# EAGLE schematic Layout_Design_File (EAGLE 9.6.2)

## Sheet 1 of 2
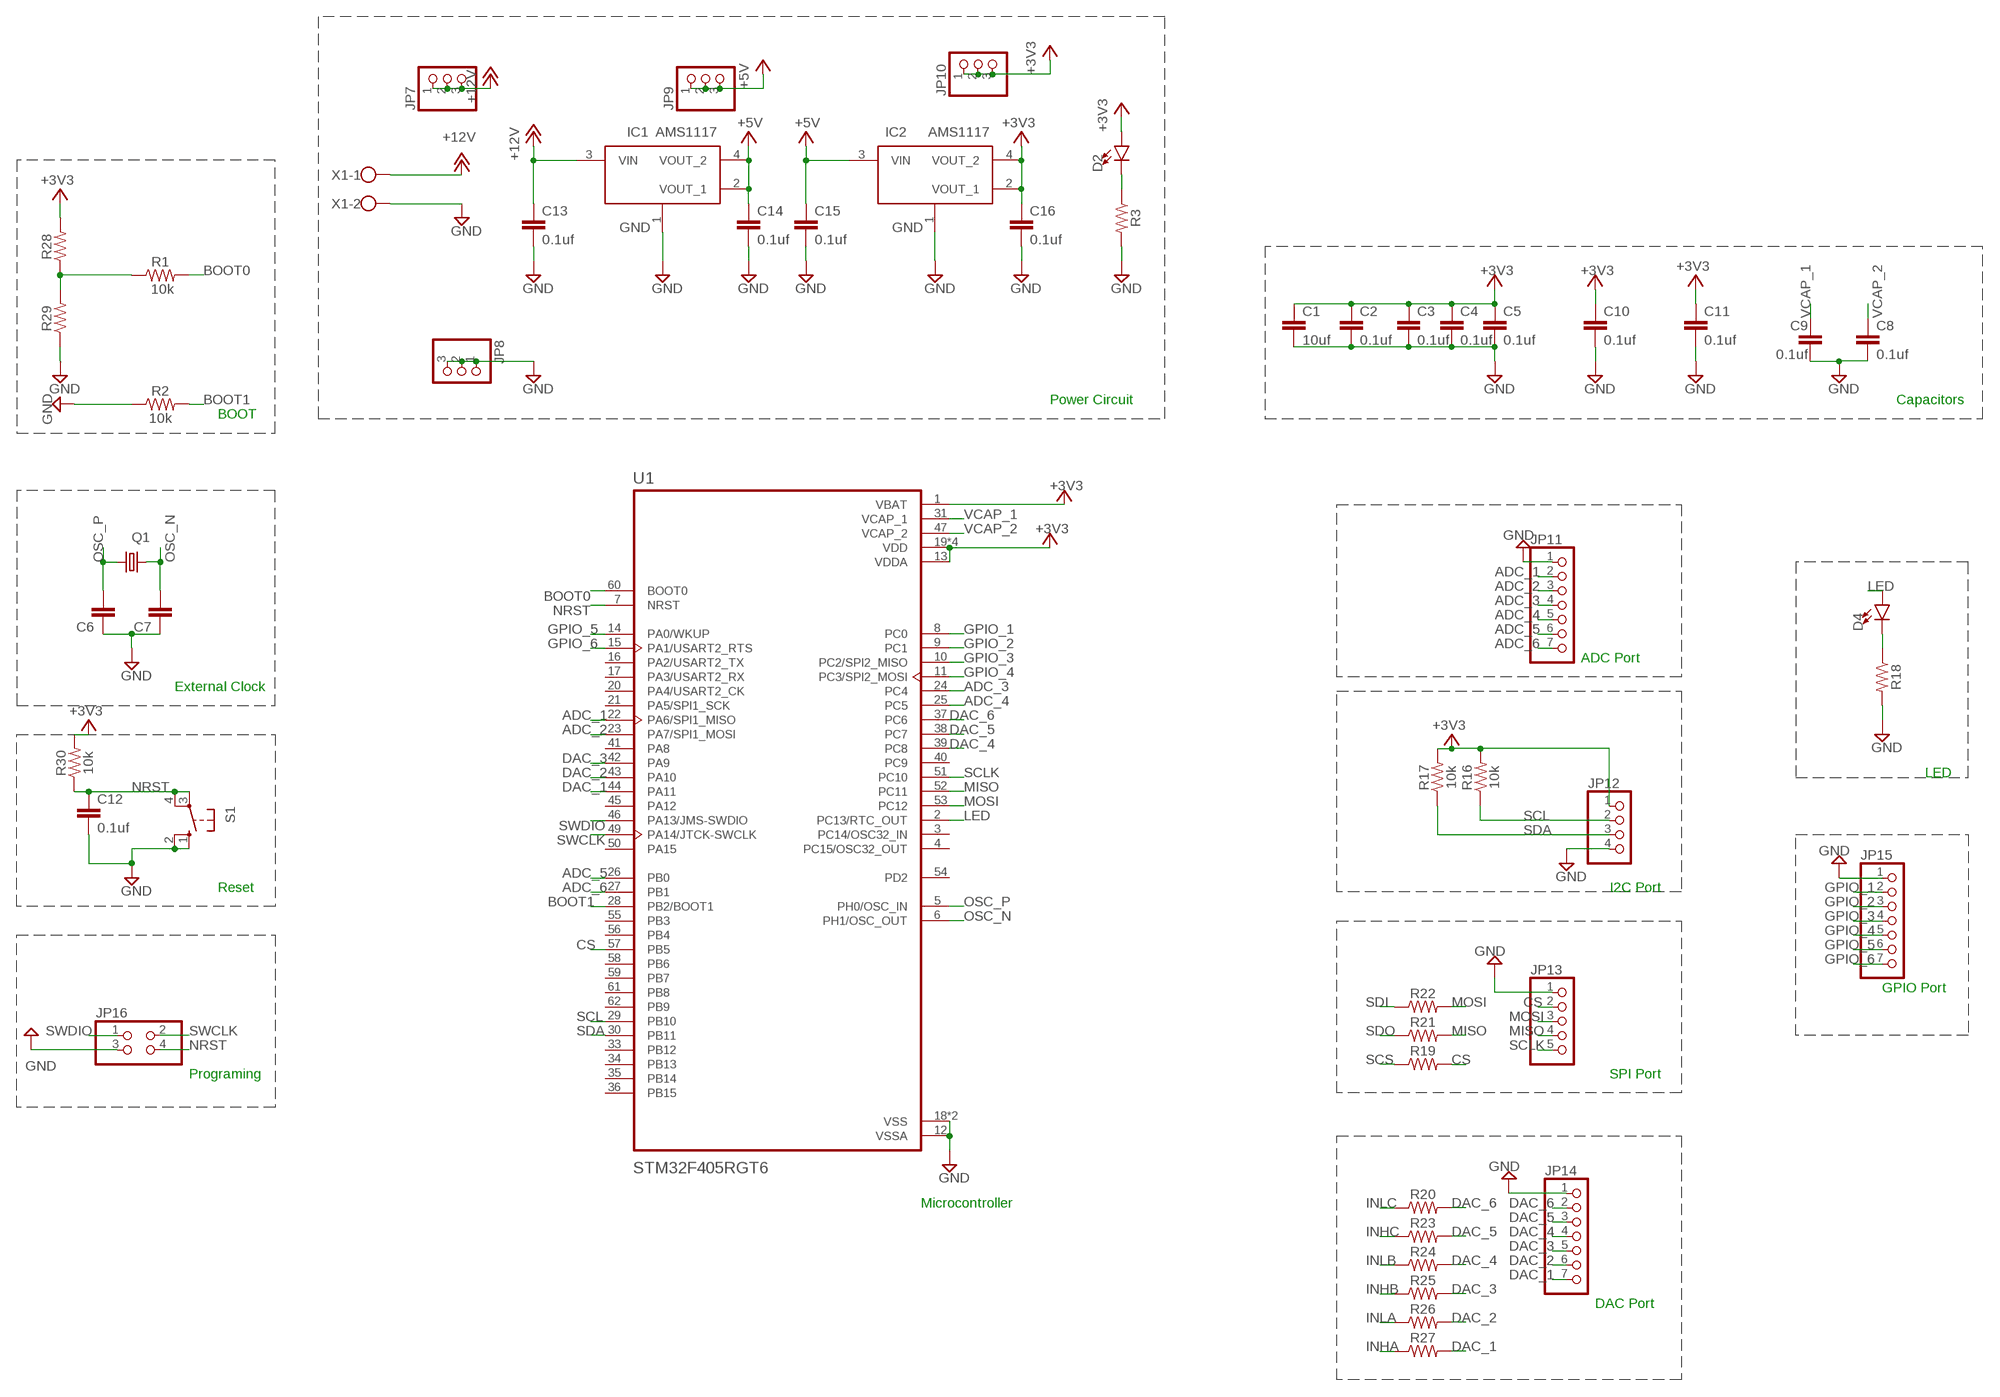
[diagram p0: schematic, sheet 1]

### Parts
C1  10uf  CAP-0603  [0603]
C2  0.1uf  CAP-0603  [0603]
C3  0.1uf  CAP-0603  [0603]
C4  0.1uf  CAP-0603  [0603]
C5  0.1uf  CAP-0603  [0603]
C6  CAP-0603  [0603]
C7  CAP-0603  [0603]
C8  0.1uf  CAP-0603  [0603]
C9  0.1uf  CAP-0603  [0603]
C10  0.1uf  CAP-0603  [0603]
C11  0.1uf  CAP-0603  [0603]
C12  0.1uf  CAP-0603  [0603]
C13  0.1uf  CAP-0603  [0603]
C14  0.1uf  CAP-0603  [0603]
C15  0.1uf  CAP-0603  [0603]
C16  0.1uf  CAP-0603  [0603]
D2  LED1206  [LED-1206]
D4  LED1206  [LED-1206]
IC1  AMS1117  [SOT229P700X180-4N]
IC2  AMS1117  [SOT229P700X180-4N]
JP7  PINHD-1X3  [1X03]
JP8  PINHD-1X3  [1X03]
JP9  PINHD-1X3  [1X03]
JP10  PINHD-1X3  [1X03]
JP11  PINHD-1X7  [1X07]
JP12  PINHD-1X4  [1X04]
JP13  PINHD-1X5  [1X05]
JP14  PINHD-1X7  [1X07]
JP15  PINHD-1X7  [1X07]
JP16  PINHD-2X2  [2X02]
Q1  CRYSTALHC49S  [HC49/S]
R1  10k  RESISTOR0603  [0603]
R2  10k  RESISTOR0603  [0603]
R3  RESISTOR0603  [0603]
R16  10k  RESISTOR0603  [0603]
R17  10k  RESISTOR0603  [0603]
R18  RESISTOR0603  [0603]
R19  RESISTOR0603  [0603]
R20  RESISTOR0603  [0603]
R21  RESISTOR0603  [0603]
R22  RESISTOR0603  [0603]
R23  RESISTOR0603  [0603]
R24  RESISTOR0603  [0603]
R25  RESISTOR0603  [0603]
R26  RESISTOR0603  [0603]
R27  RESISTOR0603  [0603]
R28  RESISTOR0603  [0603]
R29  RESISTOR0603  [0603]
R30  10k  RESISTOR0603  [0603]
S1  10-XX  [B3F-10XX]
U1  STM32F405RGT6  [QFP50P1200X1200X160-64N]
X1  W237-102  [W237-102]

### Nets
+3V3: C1.1 C2.1 C3.1 C4.1 C5.1 C10.1 C11.1 C16.1 D2.A IC2.2(VOUT_1) IC2.4(VOUT_2) JP10.1 JP10.2 JP10.3 JP12.1 R16.2 R17.2 R28.2 R30.2 U1.1(VBAT) U1.13(VDDA) U1.19(VDD) U1.32(VDD) U1.48(VDD) U1.64(VDD) ; also sheet 2
+5V: C14.1 C15.1 IC1.2(VOUT_1) IC1.4(VOUT_2) IC2.3(VIN) JP9.1 JP9.2 JP9.3
+12V: C13.1 IC1.3(VIN) JP7.1 JP7.2 JP7.3 X1.1 ; also sheet 2
ADC_1: JP11.2 U1.22(PA6/SPI1_MISO)
ADC_2: JP11.3 U1.23(PA7/SPI1_MOSI)
ADC_3: JP11.4 U1.24(PC4)
ADC_4: JP11.5 U1.25(PC5)
ADC_5: JP11.6 U1.26(PB0)
ADC_6: JP11.7 U1.27(PB1)
BOOT0: R1.2 U1.60(BOOT0)
BOOT1: R2.2 U1.28(PB2/BOOT1)
CS: JP13.2 R19.2 U1.57(PB5)
DAC_1: JP14.7 R27.2 U1.44(PA11)
DAC_2: JP14.6 R26.2 U1.43(PA10)
DAC_3: JP14.5 R25.2 U1.42(PA9)
DAC_4: JP14.4 R24.2 U1.39(PC8)
DAC_5: JP14.3 R23.2 U1.38(PC7)
DAC_6: JP14.2 R20.2 U1.37(PC6)
GND: C1.2 C2.2 C3.2 C4.2 C5.2 C6.1 C7.1 C8.2 C9.2 C10.2 C11.2 C12.2 C13.2 C14.2 C15.2 C16.2 IC1.1(GND) IC2.1(GND) JP8.1 JP8.2 JP8.3 JP11.1 JP12.4 JP13.1 JP14.1 JP15.1 JP16.3 R2.1 R3.2 R18.2 R29.1 S1.1(S) S1.2(S1) U1.12(VSSA) U1.18(VSS) U1.63(VSS) X1.2 ; also sheet 2
GPIO_1: JP15.2 U1.8(PC0)
GPIO_2: JP15.3 U1.9(PC1)
GPIO_3: JP15.4 U1.10(PC2/SPI2_MISO)
GPIO_4: JP15.5 U1.11(PC3/SPI2_MOSI)
GPIO_5: JP15.6 U1.14(PA0/WKUP)
GPIO_6: JP15.7 U1.15(PA1/USART2_RTS)
INHA: R27.1 ; also sheet 2
INHB: R25.1 ; also sheet 2
INHC: R23.1 ; also sheet 2
INLA: R26.1 ; also sheet 2
INLB: R24.1 ; also sheet 2
INLC: R20.1 ; also sheet 2
LED: D4.A U1.2(PC13/RTC_OUT)
MISO: JP13.4 R21.2 U1.52(PC11)
MOSI: JP13.3 R22.2 U1.53(PC12)
N$1: D2.C R3.1
N$2: D4.C R18.1
N$3: R1.1 R28.1 R29.2
NRST: C12.1 JP16.4 R30.1 S1.3(P) S1.4(P1) U1.7(NRST)
OSC_N: C7.2 Q1.2 U1.6(PH1/OSC_OUT)
OSC_P: C6.2 Q1.1 U1.5(PH0/OSC_IN)
SCL: JP12.2 R16.1 U1.29(PB10)
SCLK: JP13.5 U1.51(PC10) ; also sheet 2
SCS: R19.1 ; also sheet 2
SDA: JP12.3 R17.1 U1.30(PB11)
SDI: R22.1 ; also sheet 2
SDO: R21.1 ; also sheet 2
SWCLK: JP16.2 U1.49(PA14/JTCK-SWCLK)
SWDIO: JP16.1 U1.46(PA13/JMS-SWDIO)
VCAP_1: C9.1 U1.31(VCAP_1)
VCAP_2: C8.1 U1.47(VCAP_2)
Unconnected: U1.3(PC14/OSC32_IN) U1.4(PC15/OSC32_OUT) U1.16(PA2/USART2_TX) U1.17(PA3/USART2_RX) U1.20(PA4/USART2_CK) U1.21(PA5/SPI1_SCK) U1.33(PB12) U1.34(PB13) U1.35(PB14) U1.36(PB15) U1.40(PC9) U1.41(PA8) U1.45(PA12) U1.50(PA15) U1.54(PD2) U1.55(PB3) U1.56(PB4) U1.58(PB6) U1.59(PB7) U1.61(PB8) U1.62(PB9)

### Notes on the sheet
- Power Circuit | Capacitors
- BOOT
- ADC Port
- External Clock
- LED
- Reset | I2C Port
- GPIO Port
- Programing | SPI Port
- Microcontroller
- DAC Port

## Sheet 2 of 2
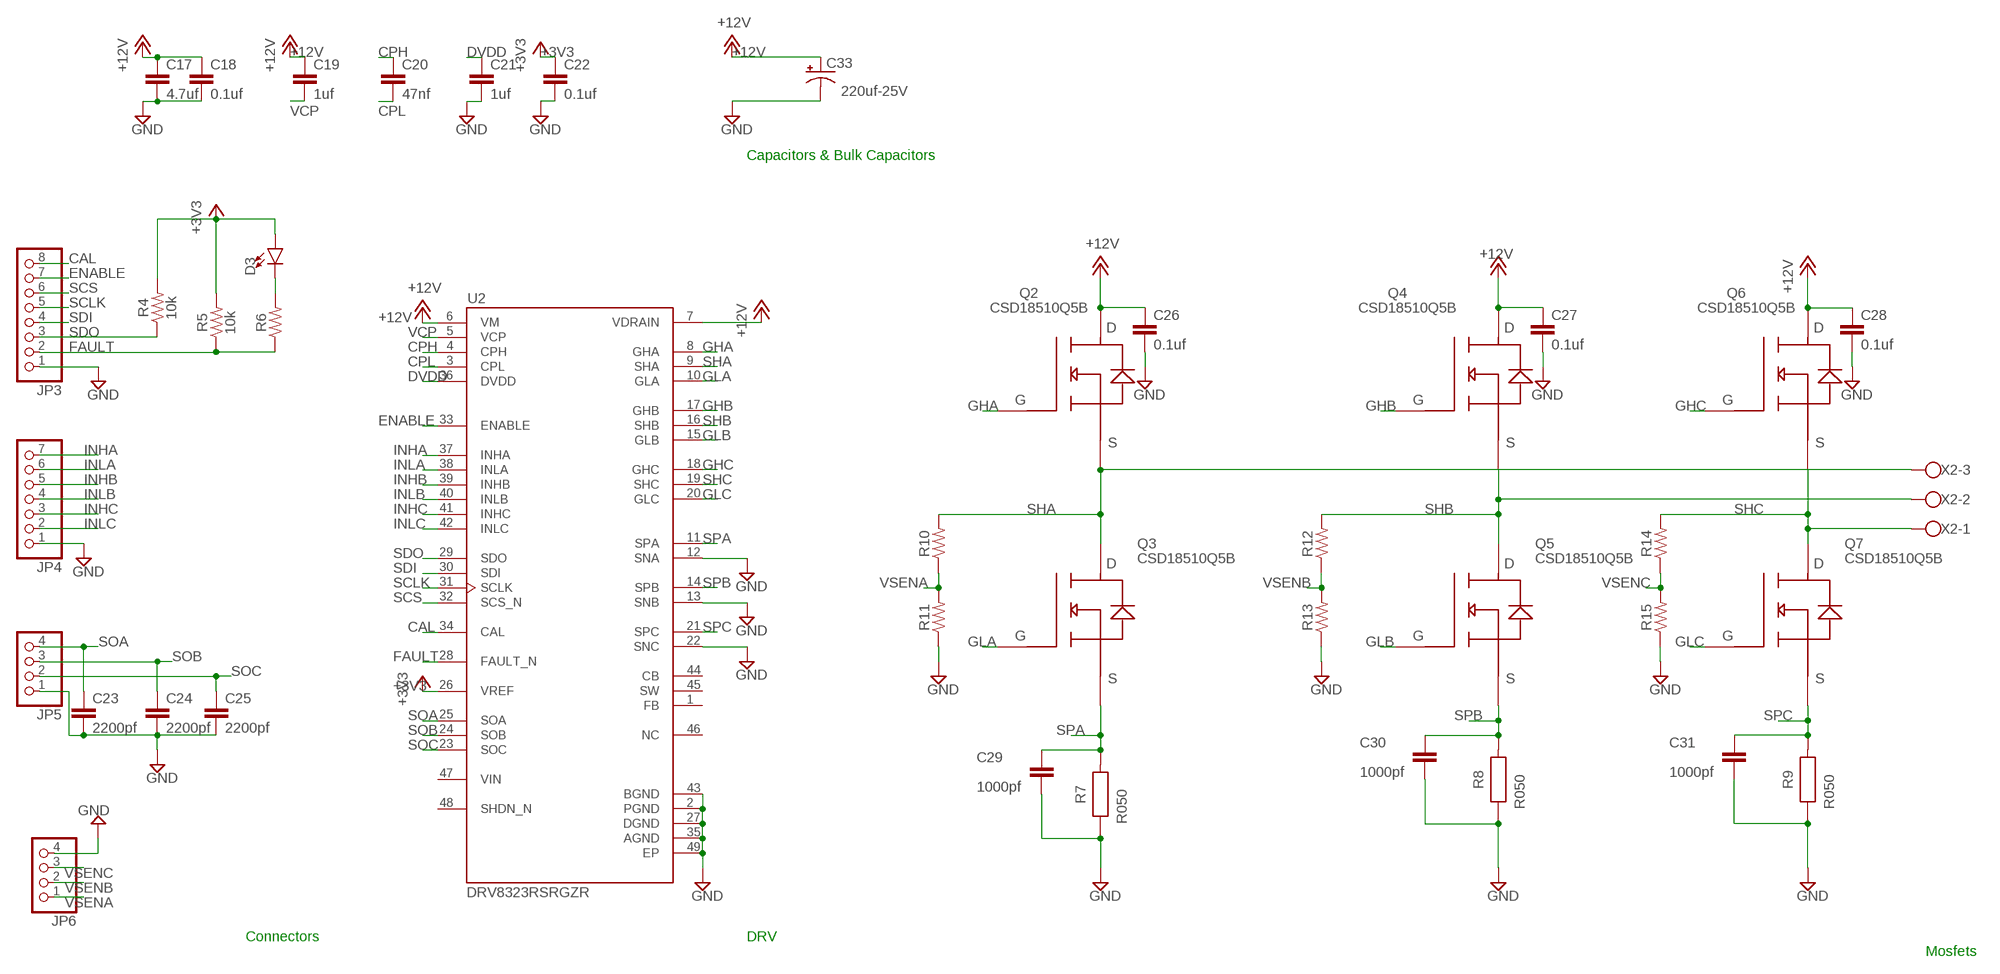
[diagram p1: schematic, sheet 2]

### Parts
C17  4.7uf  CAP-0603  [0603]
C18  0.1uf  CAP-0603  [0603]
C19  1uf  CAP-0603  [0603]
C20  47nf  CAP-0603  [0603]
C21  1uf  CAP-0603  [0603]
C22  0.1uf  CAP-0603  [0603]
C23  2200pf  CAP-0603  [0603]
C24  2200pf  CAP-0603  [0603]
C25  2200pf  CAP-0603  [0603]
C26  0.1uf  CAP-0603  [0603]
C27  0.1uf  CAP-0603  [0603]
C28  0.1uf  CAP-0603  [0603]
C29  1000pf  CAP-0603  [0603]
C30  1000pf  CAP-0603  [0603]
C31  1000pf  CAP-0603  [0603]
C33  220uf-25V  1000UF-RADIAL-5MM-25V-20%-NO-SILK  [CPOL-RADIAL-5MM-10MM-NS]
D3  LED1206  [LED-1206]
JP3  PINHD-1X8  [1X08]
JP4  PINHD-1X7  [1X07]
JP5  PINHD-1X4  [1X04]
JP6  PINHD-1X4  [1X04]
Q2  CSD18510Q5B  [CSD18540Q5BT]
Q3  CSD18510Q5B  [CSD18540Q5BT]
Q4  CSD18510Q5B  [CSD18540Q5BT]
Q5  CSD18510Q5B  [CSD18540Q5BT]
Q6  CSD18510Q5B  [CSD18540Q5BT]
Q7  CSD18510Q5B  [CSD18540Q5BT]
R4  10k  RESISTOR0603  [0603]
R5  10k  RESISTOR0603  [0603]
R6  RESISTOR0603  [0603]
R7  R050  WRIS-PSMC_2512_580070763001_6.3X3.1X0.58X2.2  [WRIS_PSMC_2512_6.3X3.1X0.58X2.2(LXWXHXPW)]
R8  R050  WRIS-PSMC_2512_580070763001_6.3X3.1X0.58X2.2  [WRIS_PSMC_2512_6.3X3.1X0.58X2.2(LXWXHXPW)]
R9  R050  WRIS-PSMC_2512_580070763001_6.3X3.1X0.58X2.2  [WRIS_PSMC_2512_6.3X3.1X0.58X2.2(LXWXHXPW)]
R10  RESISTOR0603  [0603]
R11  RESISTOR0603  [0603]
R12  RESISTOR0603  [0603]
R13  RESISTOR0603  [0603]
R14  RESISTOR0603  [0603]
R15  RESISTOR0603  [0603]
U2  DRV8323RSRGZR  [QFN50P700X700X100-49N]
X2  W237-103  [W237-103]

### Nets
+3V3: C22.1 D3.A R4.2 R5.2 U2.26(VREF) ; also sheet 1
+12V: C17.1 C18.1 C19.1 C26.1 C27.1 C28.1 C33.+ Q2.5(D) Q2.6(D) Q2.7(D) Q2.8(D) Q2.9(D) Q4.5(D) Q4.6(D) Q4.7(D) Q4.8(D) Q4.9(D) Q6.5(D) Q6.6(D) Q6.7(D) Q6.8(D) Q6.9(D) U2.6(VM) U2.7(VDRAIN) ; also sheet 1
CAL: JP3.8 U2.34(CAL)
CPH: C20.1 U2.4(CPH)
CPL: C20.2 U2.3(CPL)
DVDD: C21.1 U2.36(DVDD)
ENABLE: JP3.7 U2.33(ENABLE)
FAULT: JP3.2 R5.1 R6.1 U2.28(FAULT_N)
GHA: Q2.4(G) U2.8(GHA)
GHB: Q4.4(G) U2.17(GHB)
GHC: Q6.4(G) U2.18(GHC)
GLA: Q3.4(G) U2.10(GLA)
GLB: Q5.4(G) U2.15(GLB)
GLC: Q7.4(G) U2.20(GLC)
GND: C17.2 C18.2 C21.2 C22.2 C23.2 C24.2 C25.2 C26.2 C27.2 C28.2 C29.2 C30.2 C31.2 C33.- JP3.1 JP4.1 JP5.1 JP6.4 R7.1 R8.1 R9.1 R11.1 R13.1 R15.1 U2.2(PGND) U2.12(SNA) U2.13(SNB) U2.22(SNC) U2.27(DGND) U2.35(AGND) U2.43(BGND) U2.49(EP) ; also sheet 1
INHA: JP4.7 U2.37(INHA) ; also sheet 1
INHB: JP4.5 U2.39(INHB) ; also sheet 1
INHC: JP4.3 U2.41(INHC) ; also sheet 1
INLA: JP4.6 U2.38(INLA) ; also sheet 1
INLB: JP4.4 U2.40(INLB) ; also sheet 1
INLC: JP4.2 U2.42(INLC) ; also sheet 1
N$15: D3.C R6.2
SCLK: JP3.5 U2.31(SCLK) ; also sheet 1
SCS: JP3.6 U2.32(SCS_N) ; also sheet 1
SDI: JP3.4 U2.30(SDI) ; also sheet 1
SDO: JP3.3 R4.1 U2.29(SDO) ; also sheet 1
SHA: Q2.1(S) Q2.2(S) Q2.3(S) Q3.5(D) Q3.6(D) Q3.7(D) Q3.8(D) Q3.9(D) R10.2 U2.9(SHA) X2.3
SHB: Q4.1(S) Q4.2(S) Q4.3(S) Q5.5(D) Q5.6(D) Q5.7(D) Q5.8(D) Q5.9(D) R12.2 U2.16(SHB) X2.2
SHC: Q6.1(S) Q6.2(S) Q6.3(S) Q7.5(D) Q7.6(D) Q7.7(D) Q7.8(D) Q7.9(D) R14.2 U2.19(SHC) X2.1
SOA: C23.1 JP5.4 U2.25(SOA)
SOB: C24.1 JP5.3 U2.24(SOB)
SOC: C25.1 JP5.2 U2.23(SOC)
SPA: C29.1 Q3.1(S) Q3.2(S) Q3.3(S) R7.2 U2.11(SPA)
SPB: C30.1 Q5.1(S) Q5.2(S) Q5.3(S) R8.2 U2.14(SPB)
SPC: C31.1 Q7.1(S) Q7.2(S) Q7.3(S) R9.2 U2.21(SPC)
VCP: C19.2 U2.5(VCP)
VSENA: JP6.1 R10.1 R11.2
VSENB: JP6.2 R12.1 R13.2
VSENC: JP6.3 R14.1 R15.2
Unconnected: U2.1(FB) U2.45(SW) U2.46(NC) U2.48(SHDN_N)

### Notes on the sheet
- Capacitors & Bulk Capacitors
- Connectors | DRV
- Mosfets

## Power pins joined to a net without a drawn wire
CB: U2.44(CB)
VIN: U2.47(VIN)

## Library data of the parts
C1-C31 = SparkFun-Capacitors:CAP
C33 = SparkFun-Capacitors:1000UF: 1,000µF/1mF ceramic capacitors A capacitor is a passive two-terminal electrical component used to store electrical energy temporarily in an electric field. CAP-08070
D2-D4 = SparkFun-LED:LED: LED (Generic) Standard schematic elements and footprints for 5mm, 3mm, 1206, and 0603 sized LEDs. Generic LEDs with no color specified.
IC1 IC2 = AMS1117:AMS1117: 1117 Source: Datasheet <https://datasheet.lcsc.com/szlcsc/Advanced-Monolithic-Systems-AMS-AMS1117-ADJ_C6188.pdf>; DESCRIPTION: 1117; HEIGHT: 1.8mm; MANUFACTURER_NAME: Advanced Monolithic Systems; MANUFACTURER_PART_NUMBER: AMS1117
JP3 = pinhead:PINHD-1X8: PIN HEADER
JP4 JP11 JP14 JP15 = pinhead:PINHD-1X7: PIN HEADER
JP5 JP6 JP12 = pinhead:PINHD-1X4: PIN HEADER
JP7-JP10 = pinhead:PINHD-1X3: PIN HEADER
JP13 = pinhead:PINHD-1X5: PIN HEADER
JP16 = pinhead:PINHD-2X2: PIN HEADER
Q1 = crystal:CRYSTAL: CRYSTAL; OC_FARNELL: 1667008; OC_NEWARK: unknown
Q2-Q7 = CSD18510Q5B:CSD18510Q5B: MOSFET 40-V, N channel NexFET power MOSFET, single SON 5 mm x 6 mm, 0.96 mOhm 8-VSON-CLIP -55 to 150 Source: Datasheet <https://www.ti.com/lit/ds/symlink/csd18510q5b.pdf?ts=1680948698803&ref_url=https%3A%2F%2Fwww.ti.com%2Fproduct%2FCSD18510Q5B%2Fpart-details%2FCSD18510Q5B%3Futm_source%3Dgoogle%26utm_medium%3Dcpc%26utm_campaign%3Docb-tistore-promo->; DESCRIPTION: MOSFET 40-V, N channel NexFET power MOSFET, single SON 5 mm x 6 mm, 0.96 mOhm 8-VSON-CLIP -55 to 150; HEIGHT: 1.05mm; MANUFACTURER_NAME: Texas Instruments; MANUFACTURER_PART_NUMBER: CSD18510Q5B; MOUSER_PART_NUMBER: 595-CSD18510Q5B; MOUSER_PRICE-STOCK: https://www.mouser.co.uk/ProductDetail/Texas-Instruments/CSD18510Q5B?qs=u4fy%2FsgLU9N21MPFguzayQ%3D%3D
R1-R6 R10-R30 = SparkFun-Resistors:RESISTOR: Generic Resistor Package
R7-R9 = Wurth_Resistor_WRIS-PSMC:WRIS-PSMC_2512: WRIS-PSMC Metal Plate Resistors High Power Current Sensing Characteristics Product series for high power current sensing up to 2 W Mounting style: SMT-Chip (standard terminal) Resistance range: 2 mΩ ‒ 10 mΩ Resistance tolerance: ±1%; ±5% Rated Power: 2 W TCR: ±100 ppm/°C Operating temperature: -55°C up to +155°C Size: 2512 Recommended soldering: Reflow soldering Applications Ignition coil & igniter Motor control Inverter Battery pack Package name and Variant abbreviation: L X W X H X PW =Length X Width X Height X Pad Width <https://katalog.we-online.com/media/images/v2/o135744v209%20Family_WRIS-PSMC.jpg> Details see: https://katalog.we-online.com/en/pbs/WRIS-PSMC Created by Ella Wu 2019-09-05 2019(C) Wurth Elektronik; DATASHEET-URL: https://katalog.we-online.de/pbs/datasheet/580070763001.pdf; IR: 31.62A; MOUNT: SMT; PART-NUMBER: 580070763001; PRATED: 2W; TCR: ±100ppm/ °C; TECHNICAL-REFERENCE: MC2512R002F201KAATE0000; VALUE: 2mOhm
S1 = switch-omron:10-XX: OMRON SWITCH; MPN: B3F-1000; OC_FARNELL: 176432; OC_NEWARK: 36M3542
U1 = STM32F405RGT6s:STM32F405RGT6: High-performance foundation line, ARM Cortex-M4 core with DSP and FPU, 1 Mbyte Flash, 168 MHz CPU, ART Accelerator Check availability <https://pricing.snapeda.com/parts/STM32F405RGT6/STMicroelectronics/view-part?ref=eda>; AVAILABILITY: In Stock; CHECK_PRICES: https://www.snapeda.com/parts/STM32F405RGT6/STMicroelectronics/view-part/?ref=eda; DESCRIPTION: ARM® Cortex®-M4 STM32F4 Microcontroller IC 32-Bit Single-Core 168MHz 1MB (1M x 8) FLASH 64-LQFP (10x10); MF: STMicroelectronics; MP: STM32F405RGT6; PACKAGE: LQFP-64 STMicroelectronics; PRICE: None; PURCHASE-URL: https://www.snapeda.com/api/url_track_click_mouser/?unipart_id=105502&manufacturer=STMicroelectronics&part_name=STM32F405RGT6&search_term=None; SNAPEDA_LINK: https://www.snapeda.com/parts/STM32F405RGT6/STMicroelectronics/view-part/?ref=snap
U2 = DRV8323RSRGZR:DRV8323RSRGZR: Check availability <https://pricing.snapeda.com/parts/DRV8323RSRGZR/Texas%20Instruments/view-part?ref=eda>; AVAILABILITY: In Stock; CHECK_PRICES: https://www.snapeda.com/parts/DRV8323RSRGZR/Texas+Instruments/view-part/?ref=eda; DESCRIPTION: 65-V max 3-phase smart gate driver with buck regulator & current shunt amplifiers; MF: Texas Instruments; MP: DRV8323RSRGZR; PACKAGE: VQFN-48 Texas Instruments; PRICE: None; PURCHASE-URL: https://www.snapeda.com/api/url_track_click_mouser/?unipart_id=784067&manufacturer=Texas Instruments&part_name=DRV8323RSRGZR&search_term=drv8323rs; SNAPEDA_LINK: https://www.snapeda.com/parts/DRV8323RSRGZR/Texas+Instruments/view-part/?ref=snap
X1 = con-wago-500:W237-102: WAGO SCREW CLAMP; MPN: 237-102; OC_FARNELL: unknown; OC_NEWARK: 70K9898
X2 = con-wago-500:W237-103: WAGO SCREW CLAMP; MPN: 237-103; OC_FARNELL: unknown; OC_NEWARK: 18M7116